# Altium project LP_LED_CUBE_8x8x8.PrjPcb
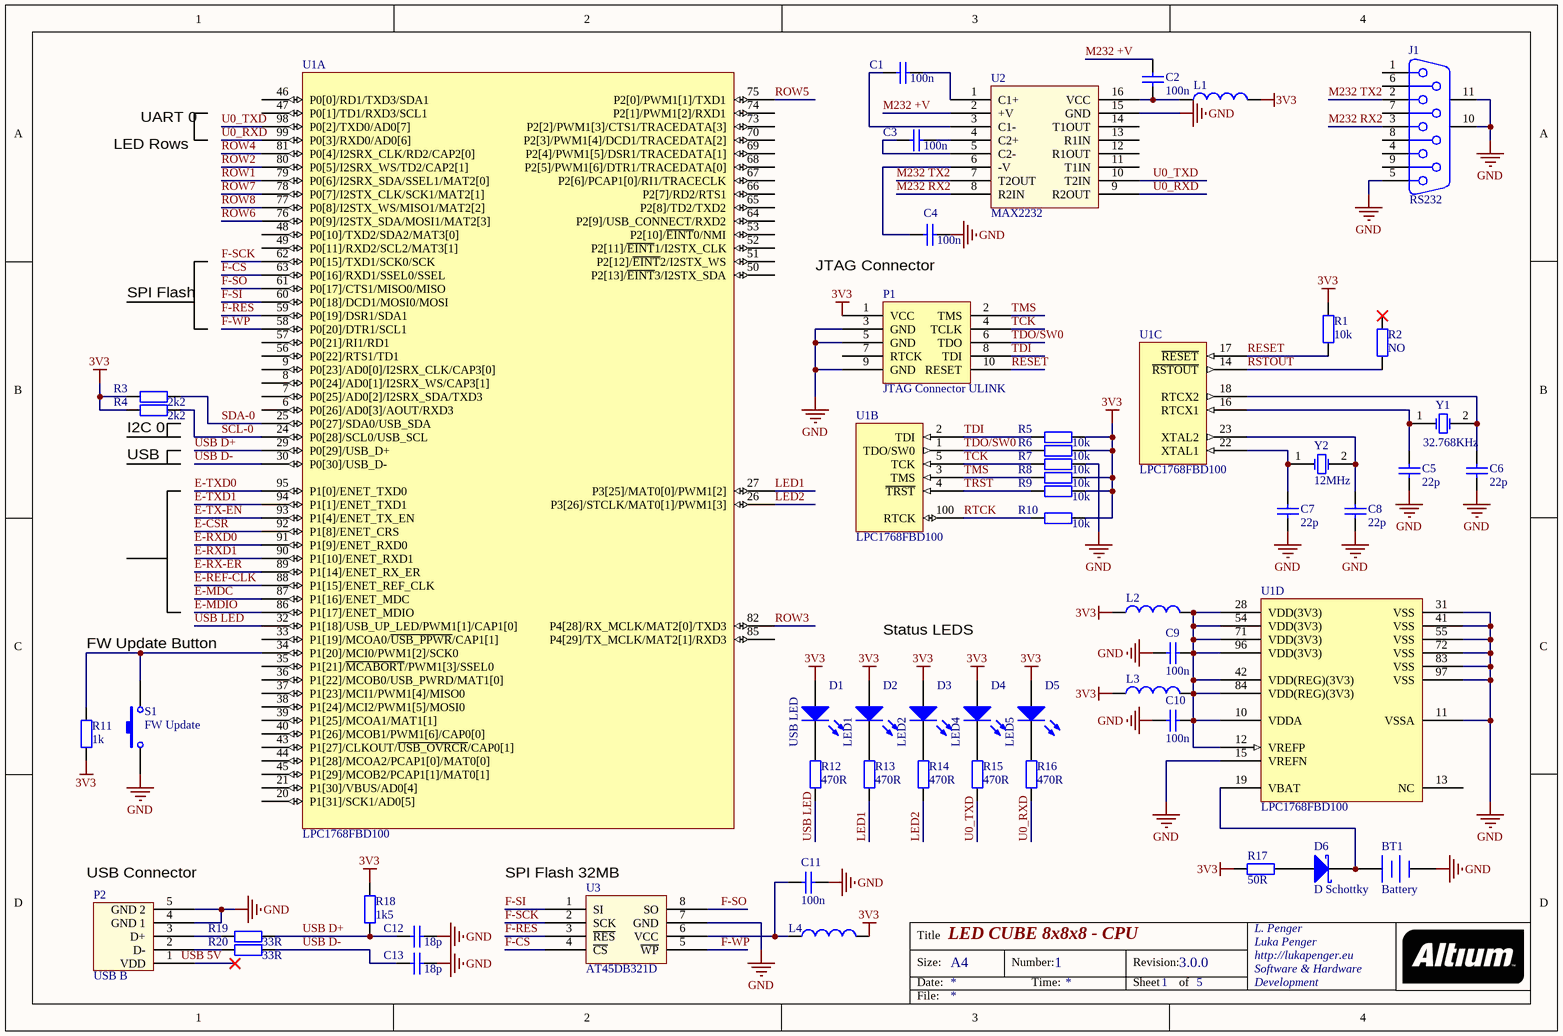
[diagram p0: CPU.SchDoc]
Title: LED Cube 8x8x8
5 sheets, 161 parts. Net scope: global (net labels, ports and power ports of the same name join across sheets).
Board file: LP_LED_CUBE_8x8x8.PcbDoc
Sheets:
  CPU.SchDoc
  POWER.SchDoc
  LED.SchDoc
  LED_ROWS.SchDoc
  ETH.SchDoc

## Sheet CPU.SchDoc: LED CUBE 8x8x8 - CPU
size A4; Author: Luka Penger; CompanyName: L. Penger; DrawnBy: Luka Penger; Organization: L. Penger; Address1: Luka Penger; Address2: http://lukapenger.eu; Address3: Software & Hardware; Address4: Development; DocumentNumber: 1; Revision: 3.0.0; SheetNumber: 1; SheetTotal: 5; DocumentName: CPU; ImagePath: I:\lp-led-cube-8x8x8\LP_LED_CUBE_8x8x8_PCB\ver_1.0.0; ProjectName: LED CUBE 8x8x8

### Parts
BT1  Battery  [Battery capacitor]
C1  100n  [1608[0603]]
C2  100n  [1608[0603]]
C3  100n  [1608[0603]]
C4  100n  [1608[0603]]
C5  22p  [1608[0603]]
C6  22p  [1608[0603]]
C7  22p  [1608[0603]]
C8  22p  [1608[0603]]
C9  100n  [1608[0603]]
C10  100n  [1608[0603]]
C11  100n  [1608[0603]]
C12  18p  [1608[0603]]
C13  18p  [1608[0603]]
D1  USB LED  [LED-1]
D2  LED1  [LED-1]
D3  LED2  [LED-1]
D4  LED4  [LED-1]
D5  LED5  [LED-1]
D6  D Schottky  [SMB]
J1  RS232  [DSUB1.385-2H9]
L1  Inductor  [1608[0603]]  (value not drawn)
L2  Inductor  [1608[0603]]  (value not drawn)
L3  Inductor  [1608[0603]]  (value not drawn)
L4  Inductor  [1608[0603]]  (value not drawn)
P1  JTAG Connector ULINK  [JTAG Connector ULINK]
P2  USB B  [USB B]
R1  10k  [1608[0603]]
R2  NO  [1608[0603]]
R3  2k2  [1608[0603]]
R4  2k2  [1608[0603]]
R5  10k  [1608[0603]]
R6  10k  [1608[0603]]
R7  10k  [1608[0603]]
R8  10k  [1608[0603]]
R9  10k  [1608[0603]]
R10  10k  [1608[0603]]
R11  1k  [1608[0603]]
R12  470R  [1608[0603]]
R13  470R  [1608[0603]]
R14  470R  [1608[0603]]
R15  470R  [1608[0603]]
R16  470R  [1608[0603]]
R17  50R  [6-0805_N]
R18  1k5  [1608[0603]]
R19  33R  [1608[0603]]
R20  33R  [1608[0603]]
S1  FW Update  [SWITCH-TACTILE-90]
U1  LPC1768FBD100  [SOT407-1_N]  (parts A,B,C,D of 4)
U2  MAX2232  [SOIC16_N]
U3  AT45DB321D  [AT45DB321D]
Y1  32.768KHz  [Crystal 4.1x1.5]
Y2  12MHz  [5x3.2 Crystal]

### Nets
3V3: D1.1(A) D2.1(A) D3.1(A) D4.1(A) D5.1(A) L1.2 L2.1 L3.1 L4.2 P1.1(VCC) R1.2 R3.1 R4.1 R5.2 R6.2 R8.2 R9.2 R10.2 R11.1 R17.2 R18.1
GND: BT1.2(-) C4.1 C5.1 C6.1 C7.1 C8.1 C9.2 C10.1 C11.1 C12.2 C13.2 J1.5 J1.10(MH1) J1.11(MH2) P1.3(GND) P1.5(GND) P1.9(GND) P2.4(GND_1) P2.5(GND_2) R7.2 S1.1 U1.11(VSSA) U1.15(VREFN) U1.31(VSS) U1.41(VSS) U1.55(VSS) U1.72(VSS) U1.83(VSS) U1.97(VSS) U2.15(GND) U3.7(GND)
E-CSR: U1.92(P1[8]/ENET_CRS)
E-MDC: U1.87(P1[16]/ENET_MDC)
E-MDIO: U1.86(P1[17]/ENET_MDIO)
E-REF-CLK: U1.88(P1[15]/ENET_REF_CLK)
E-RX-ER: U1.89(P1[14]/ENET_RX_ER)
E-RXD0: U1.91(P1[9]/ENET_RXD0)
E-RXD1: U1.90(P1[10]/ENET_RXD1)
E-TX-EN: U1.93(P1[4]/ENET_TX_EN)
E-TXD0: U1.95(P1[0]/ENET_TXD0)
E-TXD1: U1.94(P1[1]/ENET_TXD1)
F-CS: U1.63(P0[16]/RXD1/SSEL0/SSEL) U3.4(~{CS})
F-RES: U1.59(P0[19]/DSR1/SDA1) U3.3(~{RES})
F-SCK: U1.62(P0[15]/TXD1/SCK0/SCK) U3.2(SCK)
F-SI: U1.60(P0[18]/DCD1/MOSI0/MOSI) U3.1(SI)
F-SO: U1.61(P0[17]/CTS1/MISO0/MISO) U3.8(SO)
F-WP: U1.58(P0[20]/DTR1/SCL1) U3.5(~{WP})
LED1: R13.1 U1.27(P3[25]/MAT0[0]/PWM1[2])
LED2: R14.1 U1.26(P3[26]/STCLK/MAT0[1]/PWM1[3])
M232 +V: C2.1 U2.2(+V)
M232 RX2: J1.3 U2.8(R2IN)
M232 TX2: J1.2 U2.7(T2OUT)
RESET: P1.10(RESET) R1.1 U1.17(~{RESET})
ROW1: U1.79(P0[6]/I2SRX_SDA/SSEL1/MAT2[0])
ROW2: U1.80(P0[5]/I2SRX_WS/TD2/CAP2[1])
ROW3: U1.82(P4[28]/RX_MCLK/MAT2[0]/TXD3)
ROW4: U1.81(P0[4]/I2SRX_CLK/RD2/CAP2[0])
ROW5: U1.75(P2[0]/PWM1[1]/TXD1)
ROW6: U1.76(P0[9]/I2STX_SDA/MOSI1/MAT2[3])
ROW7: U1.78(P0[7]/I2STX_CLK/SCK1/MAT2[1])
ROW8: U1.77(P0[8]/I2STX_WS/MISO1/MAT2[2])
RSTOUT: R2.1 U1.14(~{RSTOUT})
RTCK: R10.1 U1.100(RTCK)
SCL-0: R4.2 U1.24(P0[28]/SCL0/USB_SCL)
SDA-0: R3.2 U1.25(P0[27]/SDA0/USB_SDA)
TCK: P1.4(TCLK) R7.1 U1.5(TCK)
TDI: P1.8(TDI) R5.1 U1.2(TDI)
TDO/SW0: P1.6(TDO) R6.1 U1.1(TDO/SW0)
TMS: P1.2(TMS) R8.1 U1.3(TMS)
TRST: R9.1 U1.4(~{TRST})
U0_RXD: R16.1 U1.99(P0[3]/RXD0/AD0[6]) U2.9(R2OUT)
U0_TXD: R15.1 U1.98(P0[2]/TXD0/AD0[7]) U2.10(T2IN)
USB D+: C12.1 R18.2 R19.1 U1.29(P0[29]/USB_D+)
USB D-: C13.1 R20.1 U1.30(P0[30]/USB_D-)
USB LED: R12.1 U1.32(P1[18]/USB_UP_LED/PWM1[1]/CAP1[0])
NetBT1_1: BT1.1(+) D6.2(K) U1.19(VBAT)
NetC1_1: C1.1 U2.3(C1-)
NetC1_2: C1.2 U2.1(C1+)
NetC2_2: C2.2 L1.1 U2.16(VCC)
NetC3_1: C3.1 U2.5(C2-)
NetC3_2: C3.2 U2.4(C2+)
NetC4_2: C4.2 U2.6(-V)
NetC5_2: C5.2 U1.16(RTCX1) Y1.1(OSC1)
NetC6_2: C6.2 U1.18(RTCX2) Y1.2(OSC2)
NetC7_2: C7.2 U1.22(XTAL1) Y2.1(OSC1)
NetC8_2: C8.2 U1.23(XTAL2) Y2.2(OSC2)
NetC9_1: C9.1 C10.2 L2.2 L3.2 U1.10(VDDA) U1.12(VREFP) U1.28(VDD(3V3)) U1.42(VDD(REG)(3V3)) U1.54(VDD(3V3)) U1.71(VDD(3V3)) U1.84(VDD(REG)(3V3)) U1.96(VDD(3V3))
NetC11_2: C11.2 L4.1 U3.6(VCC)
NetD1_2: D1.2(K) R12.2
NetD2_2: D2.2(K) R13.2
NetD3_2: D3.2(K) R14.2
NetD4_2: D4.2(K) R15.2
NetD5_2: D5.2(K) R16.2
NetD6_1: D6.1(A) R17.1
NetP2_2: P2.2(D-) R20.2
NetP2_3: P2.3(D+) R19.2
NetR11_2: R11.2 S1.2 U1.34(P1[20]/MCI0/PWM1[2]/SCK0)

Not connected (* = marked no-connect by the designer): J1 1 4 6 7 8 9; P1 7(RTCK); P2 1(VDD)*; R2 2*; U1 6(P0[26]/AD0[3]/AOUT/RXD3) 7(P0[25]/AD0[2]/I2SRX_SDA/TXD3) 8(P0[24]/AD0[1]/I2SRX_WS/CAP3[1]) 9(P0[23]/AD0[0]/I2SRX_CLK/CAP3[0]) 13(NC) 20(P1[31]/SCK1/AD0[5]) 21(P1[30]/VBUS/AD0[4]) 33(P1[19]/MCOA0/~{USB_PPWR}/CAP1[1]) 35(P1[21]/~{MCABORT}/PWM1[3]/SSEL0) 36(P1[22]/MCOB0/USB_PWRD/MAT1[0]) 37(P1[23]/MCI1/PWM1[4]/MISO0) 38(P1[24]/MCI2/PWM1[5]/MOSI0) 39(P1[25]/MCOA1/MAT1[1]) 40(P1[26]/MCOB1/PWM1[6]/CAP0[0]) 43(P1[27]/CLKOUT/~{USB_OVRCR}/CAP0[1]) 44(P1[28]/MCOA2/PCAP1[0]/MAT0[0]) 45(P1[29]/MCOB2/PCAP1[1]/MAT0[1]) 46(P0[0]/RD1/TXD3/SDA1) 47(P0[1]/TD1/RXD3/SCL1) 48(P0[10]/TXD2/SDA2/MAT3[0]) 49(P0[11]/RXD2/SCL2/MAT3[1]) 50(P2[13]/~{EINT}3/I2STX_SDA) 51(P2[12]/~{EINT}2/I2STX_WS) 52(P2[11]/~{EINT}1/I2STX_CLK) 53(P2[10]/~{EINT}0/NMI) 56(P0[22]/RTS1/TD1) 57(P0[21]/RI1/RD1) 64(P2[9]/USB_CONNECT/RXD2) 65(P2[8]/TD2/TXD2) 66(P2[7]/RD2/RTS1) 67(P2[6]/PCAP1[0]/RI1/TRACECLK) 68(P2[5]/PWM1[6]/DTR1/TRACEDATA[0]) 69(P2[4]/PWM1[5]/DSR1/TRACEDATA[1]) 70(P2[3]/PWM1[4]/DCD1/TRACEDATA[2]) 73(P2[2]/PWM1[3]/CTS1/TRACEDATA[3]) 74(P2[1]/PWM1[2]/RXD1) 85(P4[29]/TX_MCLK/MAT2[1]/RXD3); U2 11(T1IN) 12(R1OUT) 13(R1IN) 14(T1OUT)

### Notes on the sheet
- LED Rows
- UART 0
- SPI Flash
- JTAG Connector
- (near R4) I2C 0
- USB
- FW Update Button
- Status LEDS
- (near P2) USB Connector
- (near U3) SPI Flash 32MB
- Labels drawn without touching a wire or pin: USB 5V
- Title
- Size:
- Date:
- A4
- Number:
- Time:
- Revision:
- Sheet
- of
- File:

### Library data of the parts
BT1 = Battery: Multicell Battery; Published: 24-Mar-1999; LatestRevisionDate: 17-Jul-2002; LatestRevisionNote: Re-released for DXP Platform.; PackageReference: BAT-2; Publisher: Altium Limited; PackageDescription: Battery; 2 Leads
C1-C13 = Cap: Capacitor; Value: 100pF; Published: 8-Jun-2000; LatestRevisionDate: 17-Jul-2002; LatestRevisionNote: Re-released for DXP Platform.; PackageReference: RAD-0.3; Publisher: Altium Limited; PackageDescription: Radial Cap, Thru-Hole; 2 Leads; 0.3 in Pin Spacing
D1-D5 = LED0: Typical INFRARED GaAs LED; Published: 8-Jun-2000; LatestRevisionDate: 08-Jul-2005; LatestRevisionNote: Mech Layer 1 removed.; PackageReference: LED-0; Publisher: Altium Limited; PackageDescription: LED; 2 Leads
D6 = D Schottky: Schottky Diode; Published: 8-Jun-2000; LatestRevisionDate: 17-Jul-2002; LatestRevisionNote: Re-released for DXP Platform.; PackageReference: SMB; Publisher: Altium Limited; PackageDescription: DO-214-AA/SMB; 2 C-Bend Leads; Body 5.3 x 3.6 mm, inc. leads (LxW); Code_JEDEC: DO-214-AA
J1 = D Connector 9: Receptacle Assembly, 9 Position, Right Angle; PackageDocument: O; Positions: 9; Published: 15-Jun-2001; LatestRevisionDate: 17-Jul-2002; LatestRevisionNote: Re-released for DXP Platform.; DatasheetDocument: 1-Sep-1999; PackageReference: 788750; Publisher: Altium Limited; Orientation: Right Angle; Gender: Receptacle
L1-L4 = Inductor: Code_IEC: 1005; Value: 10mH; Published: 8-Jun-2000; LatestRevisionDate: 29-May-2009; LatestRevisionNote: IPC-7351 Footprint Added.; PackageReference: 0402-A; Publisher: Altium Limited; PackageDescription: Chip Inductor; Code_JEITA: 0402
P1 = JTAG Connector ULINK: JTAG Connector
P2 = USB B: USB Connector
R1-R10 R12-R20 = Res2: Resistor; Value: 1K; Published: 8-Jun-2000; LatestRevisionDate: 17-Jul-2002; LatestRevisionNote: Re-released for DXP Platform.; PackageReference: AXIAL-0.4; Publisher: Altium Limited; PackageDescription: Axial Device, Thru-Hole; 2 Leads; 0.4 in Pin Spacing
R11 = Res2: Resistor; Published: 8-Jun-2000; LatestRevisionDate: 17-Jul-2002; LatestRevisionNote: Re-released for DXP Platform.; PackageReference: AXIAL-0.4; Publisher: Altium Limited; PackageDescription: Axial Device, Thru-Hole; 2 Leads; 0.4 in Pin Spacing; Value: 1K
S1 = SW-PB: Switch; Published: 24-Mar-1999; LatestRevisionDate: 17-Jul-2002; LatestRevisionNote: Re-released for DXP Platform.; PackageReference: SPST-2; Publisher: Altium Limited; PackageDescription: Switch; 2 Leads
U1 = LPC1768FBD100: 32-bit ARM Cortex-M3 microcontroller; up to 512 kB flash and 64 kB SRAM with Ethernet, USB 2.0 Host/Device/OTG, CAN; Code_IEC: 136E20; Published: 17-Aug-2007; DatasheetVersion: rev.01, Jan-2007; PackageVersion: Feb-2003; PackageReference: SOT407-1; Publisher: Altium Limited; PackageDescription: 100-Pin Plastic Low Profile Quad Flat Pack, LQFP100; Code_JEDEC: MS-026; ComponentLink1Description: Manufacturer Link; ComponentLink1URL: http://www.nxp.com/; ComponentLink2Description: Datasheet; ComponentLink2URL: http://www.standardics.nxp.com/products/lpc2000/datasheet/lpc2364.lpc2366.lpc2368.pdf
U2 = MAX2232: Dual 232 +3V3
U3 = AT45DB321D: SPI Flash 32MB
Y1 Y2 = XTAL: Crystal Oscillator; Published: 8-Jun-2000; LatestRevisionDate: 17-Jul-2002; LatestRevisionNote: Re-released for DXP Platform.; PackageReference: R38; Publisher: Altium Limited; PackageDescription: Crystal, Thru-Hole; 2 Leads; Body 3.1 x 8.2 mm (Dia.xH)

## Sheet POWER.SchDoc: LED Cube 8x8x8 - POWER
size A4; Author: Luka Penger; CompanyName: L. Penger; DrawnBy: Luka Penger; Organization: L. Penger; Address1: Luka Penger; Address2: http://lukapenger.eu; Address3: Software & Hardware; Address4: Development; DocumentNumber: 2; Revision: 3.0.0; SheetNumber: 2; SheetTotal: 5; DocumentName: POWER; ProjectName: LED Cube 8x8x8
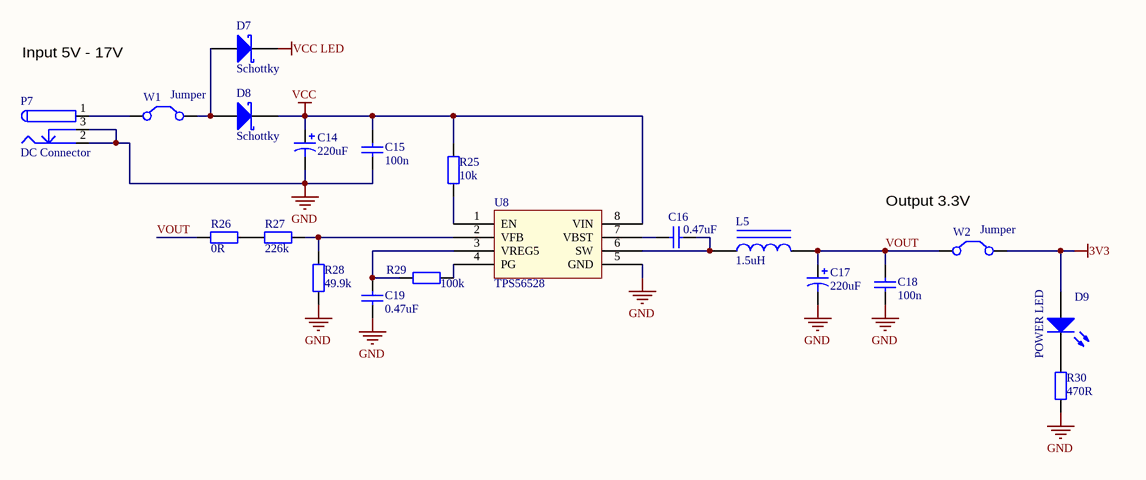
[diagram p1: POWER.SchDoc]

### Parts
C14  220uF  [SMD CAPACITOR 220uF]
C15  100n  [1608[0603]]
C16  0.47uF  [1608[0603]]
C17  220uF  [SMD CAPACITOR 220uF]
C18  100n  [1608[0603]]
C19  0.47uF  [1608[0603]]
D7  Schottky  [SMB]
D8  Schottky  [SMB]
D9  POWER LED  [LED-1]
L5  1.5uH  [Inductor]
P7  DC Connector  [DC Connector]
R25  10k  [1608[0603]]
R26  0R  [1608[0603]]
R27  226k  [1608[0603]]
R28  49.9k  [1608[0603]]
R29  100k  [1608[0603]]
R30  470R  [1608[0603]]
U8  TPS56528  [TPS56528]
W1  Jumper  [HDR1X2]
W2  Jumper  [HDR1X2]

### Nets
3V3: D9.1(A) W2.2(C2)
GND: C14.2 C15.2 C17.2 C18.2 C19.2 P7.2 P7.3 R28.1 R30.1 U8.5(GND)
VCC: C14.1 C15.1 D8.2(K) R25.2 U8.8(VIN)
VCC LED: D7.2(K)
VOUT: C17.1 C18.1 L5.2 R26.2 W2.1(C1)
NetC16_1: C16.1 U8.7(VBST)
NetC16_2: C16.2 L5.1 U8.6(SW)
NetC19_1: C19.1 R29.2 U8.3(VREG5)
NetD7_1: D7.1(A) D8.1(A) W1.2(C2)
NetD9_2: D9.2(K) R30.2
NetP7_1: P7.1 W1.1(C1)
NetR25_1: R25.1 U8.1(EN)
NetR26_1: R26.1 R27.2
NetR27_1: R27.1 R28.2 U8.2(VFB)
NetR29_1: R29.1 U8.4(PG)

### Notes on the sheet
- Input 5V - 17V
- (near W2) Output 3.3V
- Title
- Size:
- Date:
- A4
- Number:
- Time:
- Revision:
- Sheet
- of
- File:

### Library data of the parts
C14 C17 = Cap Pol1: Capacitor; Value: 100pF; Published: 8-Jun-2000; LatestRevisionDate: 17-Jul-2002; LatestRevisionNote: Re-released for DXP Platform.; PackageReference: RB7.6-15; Publisher: Altium Limited; PackageDescription: Polarized Capacitor (Radial); 2 Leads
C15 C16 C18 C19 = Cap: Capacitor; Value: 100pF; Published: 8-Jun-2000; LatestRevisionDate: 17-Jul-2002; LatestRevisionNote: Re-released for DXP Platform.; PackageReference: RAD-0.3; Publisher: Altium Limited; PackageDescription: Radial Cap, Thru-Hole; 2 Leads; 0.3 in Pin Spacing
D7 D8 = D Schottky: Schottky Diode; Published: 8-Jun-2000; LatestRevisionDate: 17-Jul-2002; LatestRevisionNote: Re-released for DXP Platform.; PackageReference: SMB; Publisher: Altium Limited; PackageDescription: DO-214-AA/SMB; 2 C-Bend Leads; Body 5.3 x 3.6 mm, inc. leads (LxW); Code_JEDEC: DO-214-AA
D9 = LED0: Typical INFRARED GaAs LED; Published: 8-Jun-2000; LatestRevisionDate: 08-Jul-2005; LatestRevisionNote: Mech Layer 1 removed.; PackageReference: LED-0; Publisher: Altium Limited; PackageDescription: LED; 2 Leads
L5 = Inductor Iron: Magnetic-Core Inductor; Value: 10mH; Published: 24-Mar-1999; LatestRevisionDate: 17-Jul-2002; LatestRevisionNote: Re-released for DXP Platform.; PackageReference: AXIAL-0.9; Publisher: Altium Limited; PackageDescription: Axial Device, Thru-Hole; 2 Leads; 0.9 in Pin Spacing
P7 = DC Connector: DC Power Connector
R25-R30 = Res2: Resistor; Value: 1K; Published: 8-Jun-2000; LatestRevisionDate: 17-Jul-2002; LatestRevisionNote: Re-released for DXP Platform.; PackageReference: AXIAL-0.4; Publisher: Altium Limited; PackageDescription: Axial Device, Thru-Hole; 2 Leads; 0.4 in Pin Spacing
U8 = TPS56528: Step-Down Converter 5A 4.5V-18V
W1 W2 = Jumper: Jumper Wire; Published: 24-Mar-1999; LatestRevisionDate: 17-Jul-2002; LatestRevisionNote: Re-released for DXP Platform.; PackageReference: RAD-0.2; Publisher: Altium Limited; PackageDescription: Radial Cap, Thru-Hole; 2 Leads; 0.2 in Pin Spacing

## Sheet LED.SchDoc: LED Cube 8x8x8 - LED
size A4; Author: Luka Penger; CompanyName: L. Penger; DrawnBy: Luka Penger; Organization: L. Penger; Address1: Luka Penger; Address2: http://lukapenger.eu; Address3: Software & Hardware; Address4: Development; DocumentNumber: 3; Revision: 3.0.0; SheetNumber: 3; SheetTotal: 5; DocumentName: LED; ProjectName: LED Cube 8x8x8
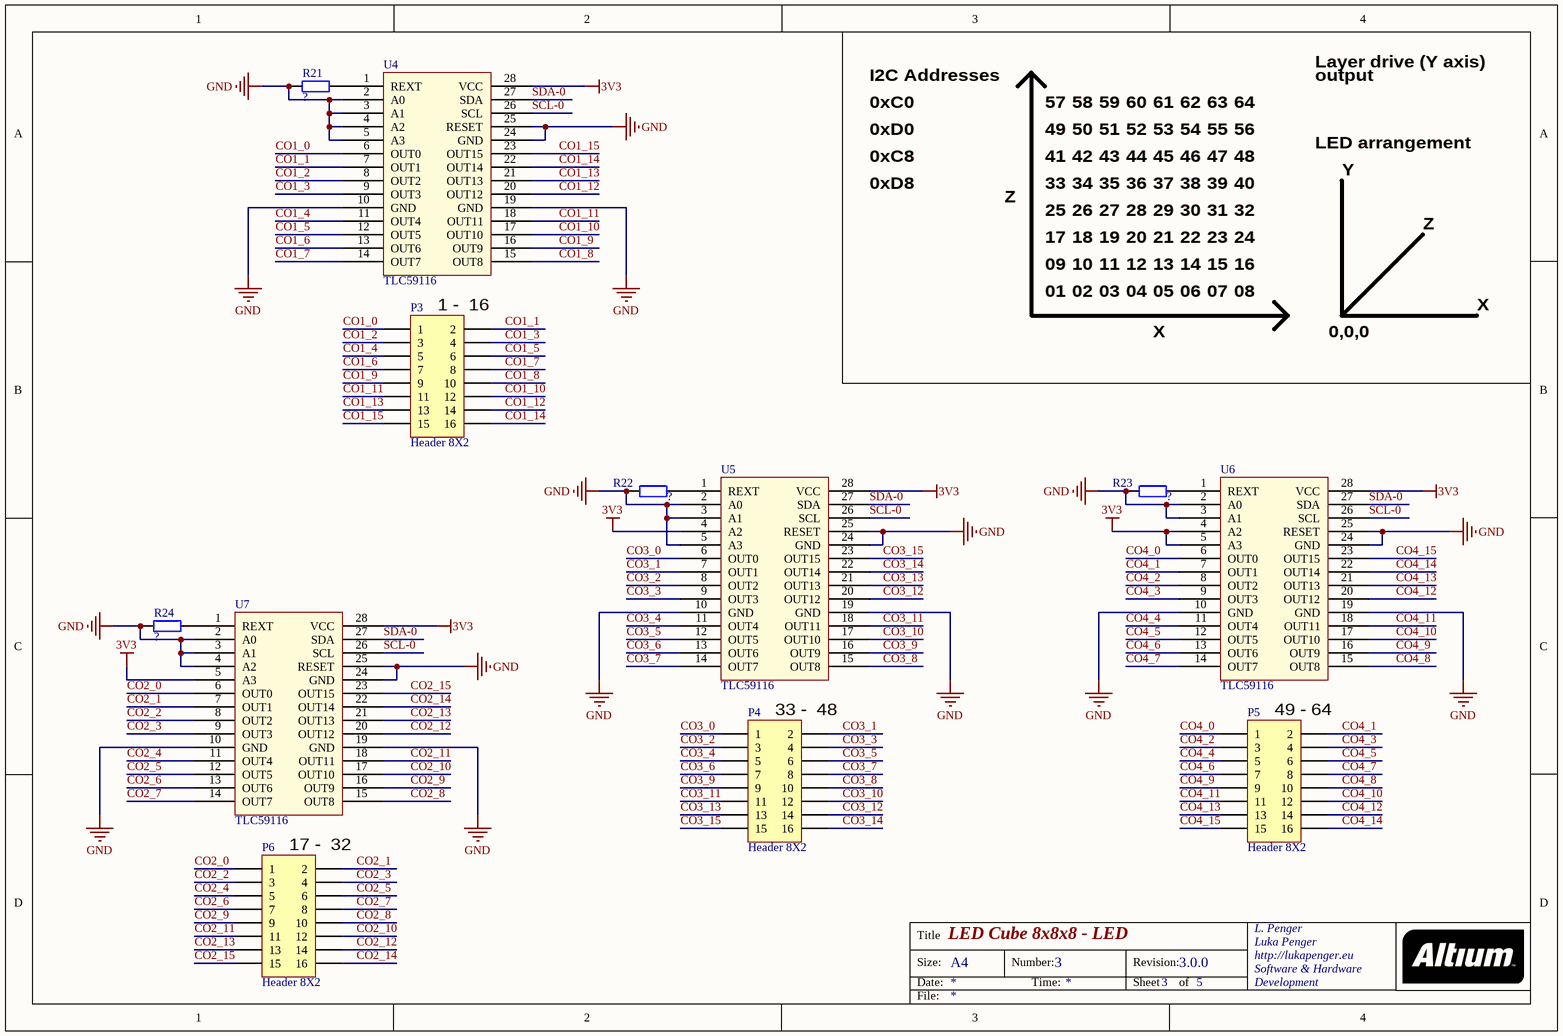
[diagram p2: LED.SchDoc]

### Parts
P3  Header 8X2  [IDC-2x8]
P4  Header 8X2  [IDC-2x8]
P5  Header 8X2  [IDC-2x8]
P6  Header 8X2  [IDC-2x8]
R21  ?  [1608[0603]]
R22  ?  [1608[0603]]
R23  ?  [1608[0603]]
R24  ?  [1608[0603]]
U4  TLC59116  [TSSOP28]
U5  TLC59116  [TSSOP28]
U6  TLC59116  [TSSOP28]
U7  TLC59116  [TSSOP28]

### Nets
3V3: U4.28(VCC) U5.4(A2) U5.28(VCC) U6.4(A2) U6.5(A3) U6.28(VCC) U7.5(A3) U7.28(VCC)
GND: R21.2 R22.1 R23.1 R24.2 U4.2(A0) U4.3(A1) U4.4(A2) U4.5(A3) U4.10(GND) U4.19(GND) U4.24(GND) U4.25(RESET) U5.2(A0) U5.3(A1) U5.5(A3) U5.10(GND) U5.19(GND) U5.24(GND) U5.25(RESET) U6.2(A0) U6.3(A1) U6.10(GND) U6.19(GND) U6.24(GND) U6.25(RESET) U7.2(A0) U7.3(A1) U7.4(A2) U7.10(GND) U7.19(GND) U7.24(GND) U7.25(RESET)
CO1_0: P3.1 U4.6(OUT0)
CO1_1: P3.2 U4.7(OUT1)
CO1_2: P3.3 U4.8(OUT2)
CO1_3: P3.4 U4.9(OUT3)
CO1_4: P3.5 U4.11(OUT4)
CO1_5: P3.6 U4.12(OUT5)
CO1_6: P3.7 U4.13(OUT6)
CO1_7: P3.8 U4.14(OUT7)
CO1_8: P3.10 U4.15(OUT8)
CO1_9: P3.9 U4.16(OUT9)
CO1_10: P3.12 U4.17(OUT10)
CO1_11: P3.11 U4.18(OUT11)
CO1_12: P3.14 U4.20(OUT12)
CO1_13: P3.13 U4.21(OUT13)
CO1_14: P3.16 U4.22(OUT14)
CO1_15: P3.15 U4.23(OUT15)
CO2_0: P6.1 U7.6(OUT0)
CO2_1: P6.2 U7.7(OUT1)
CO2_2: P6.3 U7.8(OUT2)
CO2_3: P6.4 U7.9(OUT3)
CO2_4: P6.5 U7.11(OUT4)
CO2_5: P6.6 U7.12(OUT5)
CO2_6: P6.7 U7.13(OUT6)
CO2_7: P6.8 U7.14(OUT7)
CO2_8: P6.10 U7.15(OUT8)
CO2_9: P6.9 U7.16(OUT9)
CO2_10: P6.12 U7.17(OUT10)
CO2_11: P6.11 U7.18(OUT11)
CO2_12: P6.14 U7.20(OUT12)
CO2_13: P6.13 U7.21(OUT13)
CO2_14: P6.16 U7.22(OUT14)
CO2_15: P6.15 U7.23(OUT15)
CO3_0: P4.1 U5.6(OUT0)
CO3_1: P4.2 U5.7(OUT1)
CO3_2: P4.3 U5.8(OUT2)
CO3_3: P4.4 U5.9(OUT3)
CO3_4: P4.5 U5.11(OUT4)
CO3_5: P4.6 U5.12(OUT5)
CO3_6: P4.7 U5.13(OUT6)
CO3_7: P4.8 U5.14(OUT7)
CO3_8: P4.10 U5.15(OUT8)
CO3_9: P4.9 U5.16(OUT9)
CO3_10: P4.12 U5.17(OUT10)
CO3_11: P4.11 U5.18(OUT11)
CO3_12: P4.14 U5.20(OUT12)
CO3_13: P4.13 U5.21(OUT13)
CO3_14: P4.16 U5.22(OUT14)
CO3_15: P4.15 U5.23(OUT15)
CO4_0: P5.1 U6.6(OUT0)
CO4_1: P5.2 U6.7(OUT1)
CO4_2: P5.3 U6.8(OUT2)
CO4_3: P5.4 U6.9(OUT3)
CO4_4: P5.5 U6.11(OUT4)
CO4_5: P5.6 U6.12(OUT5)
CO4_6: P5.7 U6.13(OUT6)
CO4_7: P5.8 U6.14(OUT7)
CO4_8: P5.10 U6.15(OUT8)
CO4_9: P5.9 U6.16(OUT9)
CO4_10: P5.12 U6.17(OUT10)
CO4_11: P5.11 U6.18(OUT11)
CO4_12: P5.14 U6.20(OUT12)
CO4_13: P5.13 U6.21(OUT13)
CO4_14: P5.16 U6.22(OUT14)
CO4_15: P5.15 U6.23(OUT15)
SCL-0: U4.26(SCL) U5.26(SCL) U6.26(SCL) U7.26(SCL)
SDA-0: U4.27(SDA) U5.27(SDA) U6.27(SDA) U7.27(SDA)
NetR21_1: R21.1 U4.1(REXT)
NetR22_2: R22.2 U5.1(REXT)
NetR23_2: R23.2 U6.1(REXT)
NetR24_1: R24.1 U7.1(REXT)

### Notes on the sheet
- I2C Addresses
- 0xC0
- 57
- 58
- 59
- 60
- 61
- 62
- 63
- 64
- Layer drive (Y axis)
- output
- 0xD0
- 0xC8
- 41
- 49
- 42
- 50
- 43
- 51
- 44
- 52
- 45
- 53
- 46
- 54
- 47
- 55
- 48
- 56
- LED arrangement
- Y
- 0xD8
- Z
- 17
- 25
- 33
- 18
- 26
- 34
- 19
- 27
- 35
- 20
- 28
- 36
- 21
- 29
- 37
- 22
- 30
- 38
- 23
- 31
- 39
- 24
- 32
- 40
- (near P3) 1 -  16
- 01
- 09
- 02
- 10
- 03
- 11
- 04
- 12
- 05
- 13
- 06
- 14
- 07
- 15
- 08
- 16
- X
- 0,0,0
- (near P4) 33 -  48
- (near P5) 49 - 64
- (near P6) 17 -  32
- Title
- Size:
- Date:
- A4
- Number:
- Time:
- Revision:
- Sheet
- of
- File:

### Library data of the parts
P3-P6 = Header 8X2: Header, 8-Pin, Dual row; LatestRevisionDate: 17-Jul-2002; LatestRevisionNote: Re-released for DXP Platform.; Publisher: Altium Limited
R21-R24 = Res2: Resistor; Value: 1K; Published: 8-Jun-2000; LatestRevisionDate: 17-Jul-2002; LatestRevisionNote: Re-released for DXP Platform.; PackageReference: AXIAL-0.4; Publisher: Altium Limited; PackageDescription: Axial Device, Thru-Hole; 2 Leads; 0.4 in Pin Spacing
U4-U7 = TLC59116: 16-Channel i2c LED driver

## Sheet LED_ROWS.SchDoc: LED Cube 8x8x8 - LED
size A4; Author: Luka Penger; CompanyName: L. Penger; DrawnBy: Luka Penger; Organization: L. Penger; Address1: Luka Penger; Address2: http://lukapenger.eu; Address3: Software & Hardware; Address4: Development; DocumentNumber: 4; Revision: 3.0.0; SheetNumber: 4; SheetTotal: 5; DocumentName: LED ROWS; ProjectName: LED Cube 8x8x8
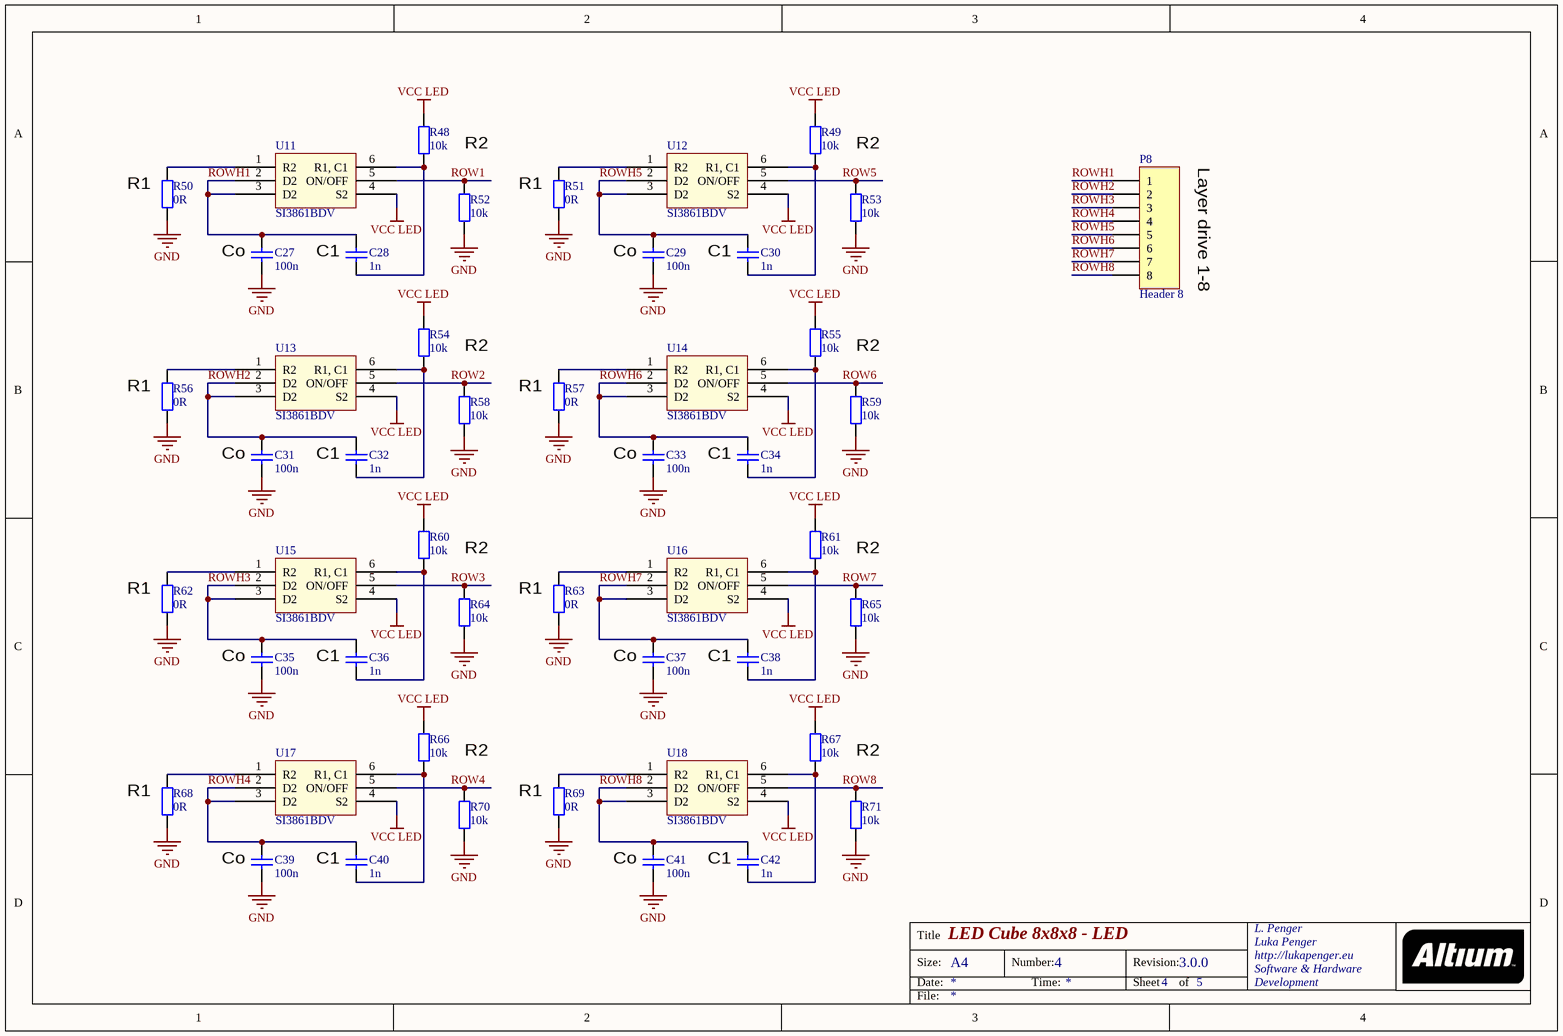
[diagram p3: LED_ROWS.SchDoc]

### Parts
C27  100n  [1608[0603]]
C28  1n  [1608[0603]]
C29  100n  [1608[0603]]
C30  1n  [1608[0603]]
C31  100n  [1608[0603]]
C32  1n  [1608[0603]]
C33  100n  [1608[0603]]
C34  1n  [1608[0603]]
C35  100n  [1608[0603]]
C36  1n  [1608[0603]]
C37  100n  [1608[0603]]
C38  1n  [1608[0603]]
C39  100n  [1608[0603]]
C40  1n  [1608[0603]]
C41  100n  [1608[0603]]
C42  1n  [1608[0603]]
P8  Header 8  [IDC-2x4]
R48  10k  [1608[0603]]
R49  10k  [1608[0603]]
R50  0R  [1608[0603]]
R51  0R  [1608[0603]]
R52  10k  [1608[0603]]
R53  10k  [1608[0603]]
R54  10k  [1608[0603]]
R55  10k  [1608[0603]]
R56  0R  [1608[0603]]
R57  0R  [1608[0603]]
R58  10k  [1608[0603]]
R59  10k  [1608[0603]]
R60  10k  [1608[0603]]
R61  10k  [1608[0603]]
R62  0R  [1608[0603]]
R63  0R  [1608[0603]]
R64  10k  [1608[0603]]
R65  10k  [1608[0603]]
R66  10k  [1608[0603]]
R67  10k  [1608[0603]]
R68  0R  [1608[0603]]
R69  0R  [1608[0603]]
R70  10k  [1608[0603]]
R71  10k  [1608[0603]]
U11  SI3861BDV  [TSOP 6]
U12  SI3861BDV  [TSOP 6]
U13  SI3861BDV  [TSOP 6]
U14  SI3861BDV  [TSOP 6]
U15  SI3861BDV  [TSOP 6]
U16  SI3861BDV  [TSOP 6]
U17  SI3861BDV  [TSOP 6]
U18  SI3861BDV  [TSOP 6]

### Nets
GND: C27.2 C29.2 C31.2 C33.2 C35.2 C37.2 C39.2 C41.2 R50.2 R51.2 R52.1 R53.1 R56.2 R57.2 R58.1 R59.1 R62.2 R63.2 R64.1 R65.1 R68.2 R69.2 R70.1 R71.1
VCC LED: R48.2 R49.2 R54.2 R55.2 R60.2 R61.2 R66.2 R67.2 U11.4(S2) U12.4(S2) U13.4(S2) U14.4(S2) U15.4(S2) U16.4(S2) U17.4(S2) U18.4(S2)
ROW1: R52.2 U11.5(ON/OFF)
ROW2: R58.2 U13.5(ON/OFF)
ROW3: R64.2 U15.5(ON/OFF)
ROW4: R70.2 U17.5(ON/OFF)
ROW5: R53.2 U12.5(ON/OFF)
ROW6: R59.2 U14.5(ON/OFF)
ROW7: R65.2 U16.5(ON/OFF)
ROW8: R71.2 U18.5(ON/OFF)
ROWH1: C27.1 C28.1 P8.1 U11.2(D2) U11.3(D2)
ROWH2: C31.1 C32.1 P8.2 U13.2(D2) U13.3(D2)
ROWH3: C35.1 C36.1 P8.3 U15.2(D2) U15.3(D2)
ROWH4: C39.1 C40.1 P8.4 U17.2(D2) U17.3(D2)
ROWH5: C29.1 C30.1 P8.5 U12.2(D2) U12.3(D2)
ROWH6: C33.1 C34.1 P8.6 U14.2(D2) U14.3(D2)
ROWH7: C37.1 C38.1 P8.7 U16.2(D2) U16.3(D2)
ROWH8: C41.1 C42.1 P8.8 U18.2(D2) U18.3(D2)
NetC28_2: C28.2 R48.1 U11.6(R1,_C1)
NetC30_2: C30.2 R49.1 U12.6(R1,_C1)
NetC32_2: C32.2 R54.1 U13.6(R1,_C1)
NetC34_2: C34.2 R55.1 U14.6(R1,_C1)
NetC36_2: C36.2 R60.1 U15.6(R1,_C1)
NetC38_2: C38.2 R61.1 U16.6(R1,_C1)
NetC40_2: C40.2 R66.1 U17.6(R1,_C1)
NetC42_2: C42.2 R67.1 U18.6(R1,_C1)
NetR50_1: R50.1 U11.1(R2)
NetR51_1: R51.1 U12.1(R2)
NetR56_1: R56.1 U13.1(R2)
NetR57_1: R57.1 U14.1(R2)
NetR62_1: R62.1 U15.1(R2)
NetR63_1: R63.1 U16.1(R2)
NetR68_1: R68.1 U17.1(R2)
NetR69_1: R69.1 U18.1(R2)

### Notes on the sheet
- R2
- Layer drive 1-8
- (near R50) R1
- (near R51) R1
- (near C27) Co
- (near C28) C1
- (near C29) Co
- (near C30) C1
- (near R56) R1
- (near R57) R1
- (near C31) Co
- (near C32) C1
- (near C33) Co
- (near C34) C1
- (near R62) R1
- (near R63) R1
- (near C35) Co
- (near C36) C1
- (near C37) Co
- (near C38) C1
- (near R68) R1
- (near R69) R1
- (near C39) Co
- (near C40) C1
- (near C41) Co
- (near C42) C1
- Title
- Size:
- Date:
- A4
- Number:
- Time:
- Revision:
- Sheet
- of
- File:

### Library data of the parts
C27-C42 = Cap: Capacitor; Value: 100pF; Published: 8-Jun-2000; LatestRevisionDate: 17-Jul-2002; LatestRevisionNote: Re-released for DXP Platform.; PackageReference: RAD-0.3; Publisher: Altium Limited; PackageDescription: Radial Cap, Thru-Hole; 2 Leads; 0.3 in Pin Spacing
P8 = Header 8: Header, 8-Pin; LatestRevisionDate: 17-Jul-2002; LatestRevisionNote: Re-released for DXP Platform.; Publisher: Altium Limited
R48-R71 = Res2: Resistor; Value: 1K; Published: 8-Jun-2000; LatestRevisionDate: 17-Jul-2002; LatestRevisionNote: Re-released for DXP Platform.; PackageReference: AXIAL-0.4; Publisher: Altium Limited; PackageDescription: Axial Device, Thru-Hole; 2 Leads; 0.4 in Pin Spacing
U11-U18 = SI3861BDV: 4.5 - 20V 2.3A Load Switch

## Sheet ETH.SchDoc: LED Cube 8x8x8 - Ethernet
size A4; Author: Luka Penger; CompanyName: L. Penger; DrawnBy: Luka Penger; Organization: L. Penger; Address1: Luka Penger; Address2: http://lukapenger.eu; Address3: Software & Hardware; Address4: Development; DocumentNumber: 5; Revision: 3.0.0; SheetNumber: 5; SheetTotal: 5; DocumentName: ETH; ProjectName: LED Cube 8x8x8
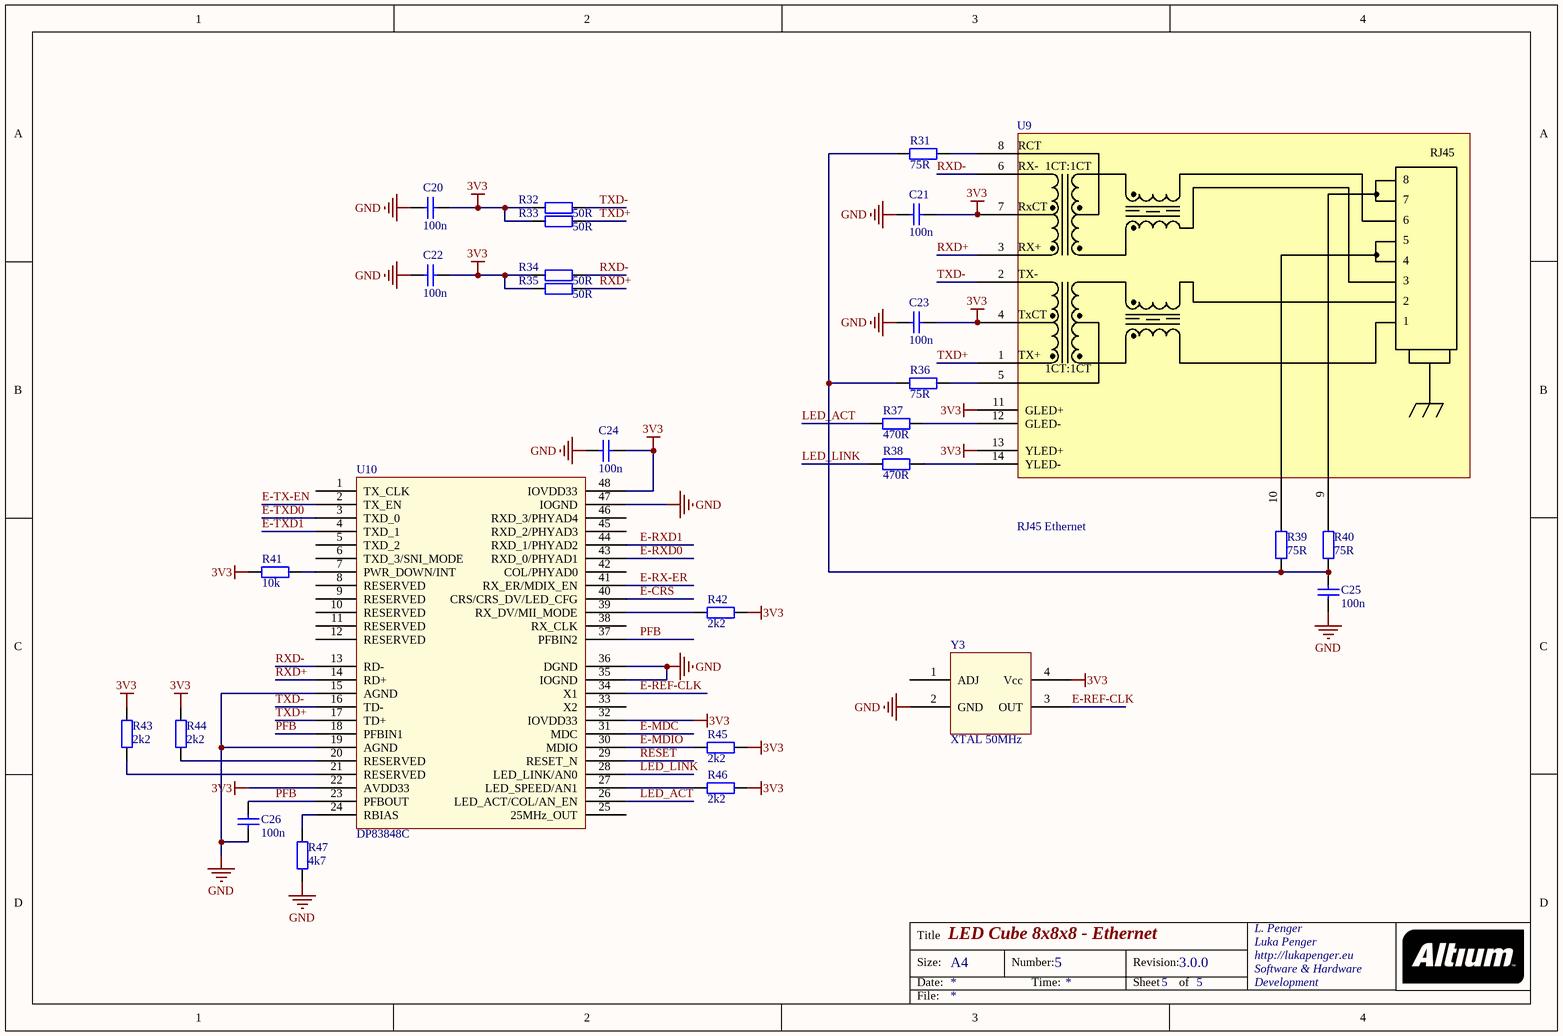
[diagram p4: ETH.SchDoc]

### Parts
C20  100n  [1608[0603]]
C21  100n  [1608[0603]]
C22  100n  [1608[0603]]
C23  100n  [1608[0603]]
C24  100n  [1608[0603]]
C25  100n  [1608[0603]]
C26  100n  [6-0805_L]
R31  75R  [1608[0603]]
R32  50R  [1608[0603]]
R33  50R  [1608[0603]]
R34  50R  [1608[0603]]
R35  50R  [1608[0603]]
R36  75R  [1608[0603]]
R37  470R  [1608[0603]]
R38  470R  [1608[0603]]
R39  75R  [1608[0603]]
R40  75R  [1608[0603]]
R41  10k  [1608[0603]]
R42  2k2  [1608[0603]]
R43  2k2  [1608[0603]]
R44  2k2  [1608[0603]]
R45  2k2  [1608[0603]]
R46  2k2  [1608[0603]]
R47  4k7  [1608[0603]]
U9  RJ45 Ethernet  [RJ45 Ethernet connector]
U10  DP83848C  [DP83848C]
Y3  XTAL 50MHz  [XTAL ACT9200]

### Nets
3V3: C20.2 C21.2 C22.2 C23.2 C24.2 R32.2 R33.2 R34.2 R35.2 R41.2 R42.1 R43.1 R44.2 R45.1 R46.1 U9.4 U9.7 U9.11(GLED+) U9.13(YLED+) U10.22(AVDD33) U10.32(IOVDD33) U10.48(IOVDD33) Y3.4(Vcc)
GND: C20.1 C21.1 C22.1 C23.1 C24.1 C25.2 C26.2 R47.2 U10.15(AGND) U10.19(AGND) U10.35(IOGND) U10.36(DGND) U10.47(IOGND) Y3.2(GND)
E-CRS: U10.40(CRS/CRS_DV/LED_CFG)
E-MDC: U10.31(MDC)
E-MDIO: R45.2 U10.30(MDIO)
E-REF-CLK: U10.34(X1) Y3.3(OUT)
E-RX-ER: U10.41(RX_ER/MDIX_EN)
E-RXD0: U10.43(RXD_0/PHYAD1)
E-RXD1: U10.44(RXD_1/PHYAD2)
E-TX-EN: U10.2(TX_EN)
E-TXD0: U10.3(TXD_0)
E-TXD1: U10.4(TXD_1)
LED_ACT: R37.2 U10.26(LED_ACT/COL/AN_EN)
LED_LINK: R38.2 U10.28(LED_LINK/AN0)
PFB: C26.1 U10.18(PFBIN1) U10.23(PFBOUT) U10.37(PFBIN2)
RESET: U10.29(RESET_N)
RXD+: R35.1 U9.3 U10.14(RD+)
RXD-: R34.1 U9.6 U10.13(RD-)
TXD+: R33.1 U9.1 U10.17(TD+)
TXD-: R32.1 U9.2 U10.16(TD-)
NetC25_1: C25.1 R31.2 R36.2 R39.1 R40.1
NetR31_1: R31.1 U9.8
NetR36_1: R36.1 U9.5
NetR37_1: R37.1 U9.12(GLED-)
NetR38_1: R38.1 U9.14(YLED-)
NetR39_2: R39.2 U9.10
NetR40_2: R40.2 U9.9
NetR41_1: R41.1 U10.7(PWR_DOWN/INT)
NetR42_2: R42.2 U10.39(RX_DV/MII_MODE)
NetR43_2: R43.2 U10.21(RESERVED)
NetR44_1: R44.1 U10.20(RESERVED)
NetR46_2: R46.2 U10.27(LED_SPEED/AN1)
NetR47_1: R47.1 U10.24(RBIAS)

Not connected (* = marked no-connect by the designer): U10 1(TX_CLK) 5(TXD_2) 6(TXD_3/SNI_MODE) 8(RESERVED) 9(RESERVED) 10(RESERVED) 11(RESERVED) 12(RESERVED) 25(25MHz_OUT) 33(X2) 38(RX_CLK) 42(COL/PHYAD0) 45(RXD_2/PHYAD3) 46(RXD_3/PHYAD4); Y3 1(ADJ)

### Notes on the sheet
- Title
- Size:
- Date:
- A4
- Number:
- Time:
- Revision:
- Sheet
- of
- File:
- (in symbol RJ45 Ethernet) RCT; RJ45; RX-; 1CT:1CT; RxCT; RX+; TX-; TxCT; TX+

### Library data of the parts
C20-C26 = Cap: Capacitor; Value: 100pF; Published: 8-Jun-2000; LatestRevisionDate: 17-Jul-2002; LatestRevisionNote: Re-released for DXP Platform.; PackageReference: RAD-0.3; Publisher: Altium Limited; PackageDescription: Radial Cap, Thru-Hole; 2 Leads; 0.3 in Pin Spacing
R31-R47 = Res2: Resistor; Value: 1K; Published: 8-Jun-2000; LatestRevisionDate: 17-Jul-2002; LatestRevisionNote: Re-released for DXP Platform.; PackageReference: AXIAL-0.4; Publisher: Altium Limited; PackageDescription: Axial Device, Thru-Hole; 2 Leads; 0.4 in Pin Spacing
U9 = RJ45 Ethernet: Ethernet Connector
U10 = DP83848C: Ethernet PHY
Y3 = XTAL ACT9200

## Nets that join several sheets
3V3: CPU (21 pins), POWER (D9.1 W2.2), LED (8 pins), ETH (23 pins)
GND: CPU (31 pins), POWER (10 pins), LED (32 pins), LED_ROWS (24 pins), ETH (14 pins)
VCC LED: POWER (D7.2), LED_ROWS (16 pins)
E-MDC: CPU (U1.87), ETH (U10.31)
E-MDIO: CPU (U1.86), ETH (R45.2 U10.30)
E-REF-CLK: CPU (U1.88), ETH (U10.34 Y3.3)
E-RX-ER: CPU (U1.89), ETH (U10.41)
E-RXD0: CPU (U1.91), ETH (U10.43)
E-RXD1: CPU (U1.90), ETH (U10.44)
E-TX-EN: CPU (U1.93), ETH (U10.2)
E-TXD0: CPU (U1.95), ETH (U10.3)
E-TXD1: CPU (U1.94), ETH (U10.4)
RESET: CPU (P1.10 R1.1 U1.17), ETH (U10.29)
ROW1: CPU (U1.79), LED_ROWS (R52.2 U11.5)
ROW2: CPU (U1.80), LED_ROWS (R58.2 U13.5)
ROW3: CPU (U1.82), LED_ROWS (R64.2 U15.5)
ROW4: CPU (U1.81), LED_ROWS (R70.2 U17.5)
ROW5: CPU (U1.75), LED_ROWS (R53.2 U12.5)
ROW6: CPU (U1.76), LED_ROWS (R59.2 U14.5)
ROW7: CPU (U1.78), LED_ROWS (R65.2 U16.5)
ROW8: CPU (U1.77), LED_ROWS (R71.2 U18.5)
SCL-0: CPU (R4.2 U1.24), LED (U4.26 U5.26 U6.26 U7.26)
SDA-0: CPU (R3.2 U1.25), LED (U4.27 U5.27 U6.27 U7.27)